# Altium project Thrust Stand Controller Revised.PrjPcb
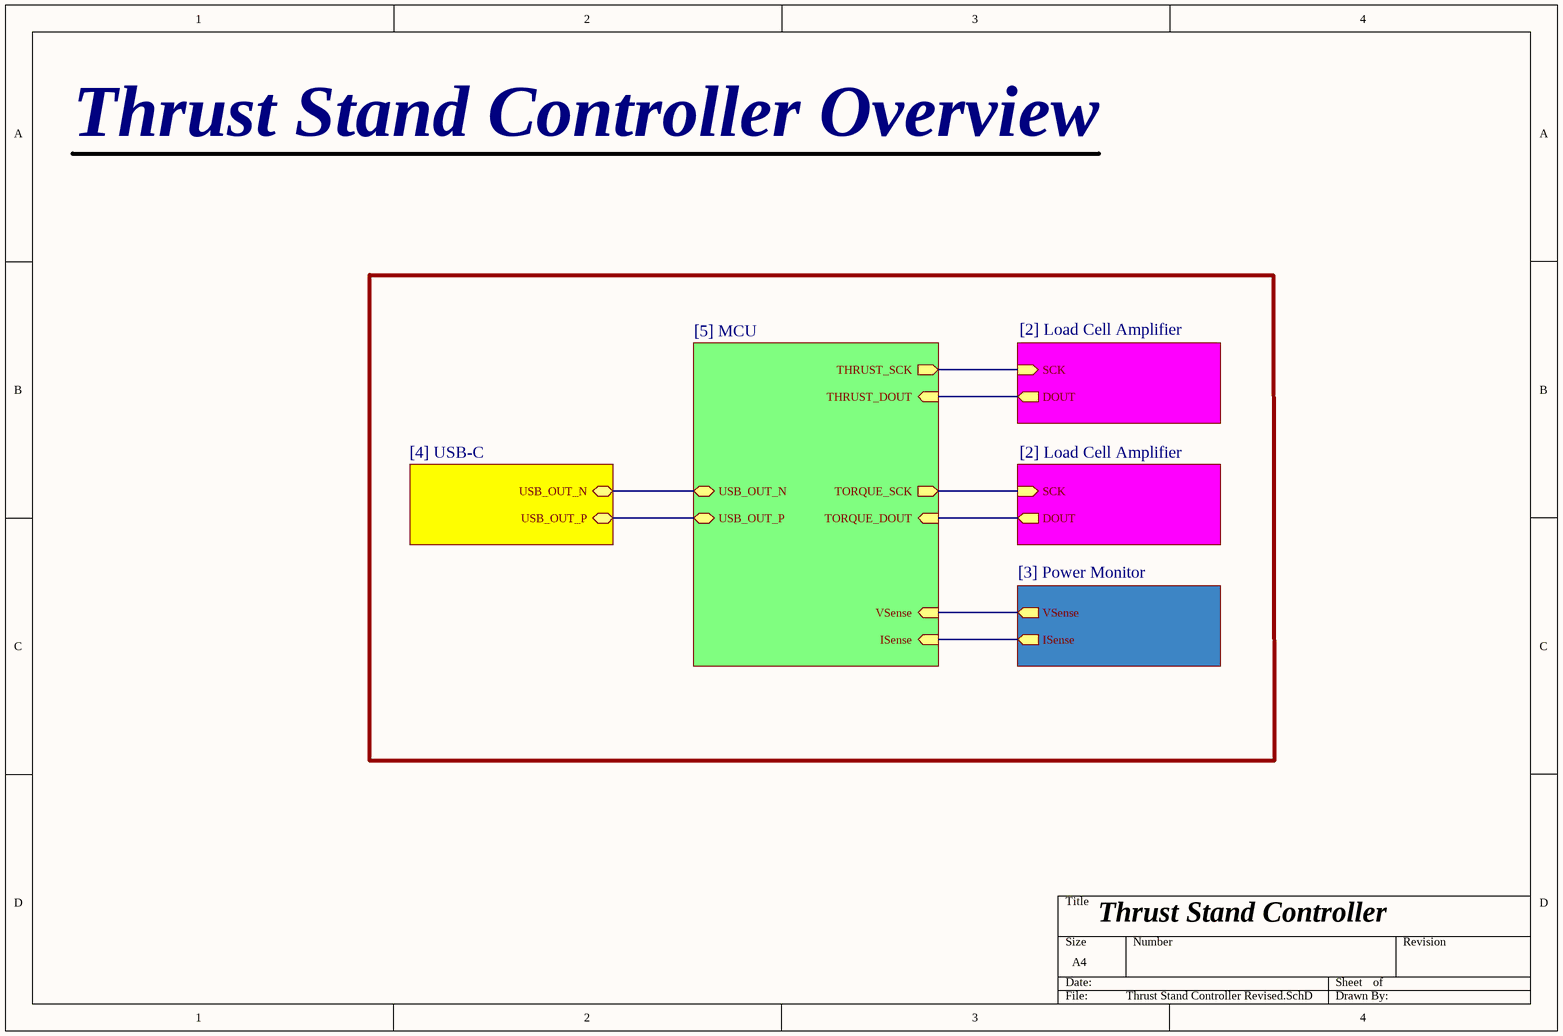
[diagram p0: Thrust Stand Controller Revised.SchDoc]
5 sheets, 68 parts. Net scope: hierarchical (ports join the sheet entries above them; power ports are global).
Board file: Thrust Stand Controller.PcbDoc
Sheets:
  Thrust Stand Controller Revised.SchDoc
    [2] Load Cell Amplifier = Load Cell Amplifier.SchDoc
    [4] USB-C = USB-C.SchDoc
    [3] Power Monitor = Power Monitor.SchDoc
    [2] Load Cell Amplifier = Load Cell Amplifier.SchDoc
    [5] MCU = MCU.SchDoc

## Sheet Thrust Stand Controller Revised.SchDoc
size A4; SheetNumber: 1; SheetTotal: 5

### Sub-sheets
[2] Load Cell Amplifier = Load Cell Amplifier.SchDoc: DOUT (out), SCK (in)
[2] Load Cell Amplifier = Load Cell Amplifier.SchDoc: DOUT (out), SCK (in)
[3] Power Monitor = Power Monitor.SchDoc: VSense (out), ISense (out)
[4] USB-C = USB-C.SchDoc: USB_OUT_N (bidir), USB_OUT_P (bidir)
[5] MCU = MCU.SchDoc: USB_OUT_N (bidir), USB_OUT_P (bidir), VSense (in), ISense (in), THRUST_SCK (out), THRUST_DOUT (in), TORQUE_SCK (out), TORQUE_DOUT (in)

### Nets
DOUT: sheet [2] Load Cell Amplifier/DOUT, sheet [5] MCU/TORQUE_DOUT
DOUT: sheet [2] Load Cell Amplifier/DOUT, sheet [5] MCU/THRUST_DOUT  [a separate net that carries the same name]
ISense: sheet [3] Power Monitor/ISense, sheet [5] MCU/ISense
SCK: sheet [2] Load Cell Amplifier/SCK, sheet [5] MCU/TORQUE_SCK
SCK: sheet [2] Load Cell Amplifier/SCK, sheet [5] MCU/THRUST_SCK  [a separate net that carries the same name]
USB_OUT_N: sheet [4] USB-C/USB_OUT_N, sheet [5] MCU/USB_OUT_N
USB_OUT_P: sheet [4] USB-C/USB_OUT_P, sheet [5] MCU/USB_OUT_P
VSense: sheet [3] Power Monitor/VSense, sheet [5] MCU/VSense

### Notes on the sheet
- Thrust Stand Controller Overview
- Thrust Stand Controller

## Sheet Load Cell Amplifier.SchDoc
size A4; SheetNumber: 2; SheetTotal: 5
Used 2 times, as channels [2] Load Cell Amplifier, [2] Load Cell Amplifier. Parts and nets are listed once, with the designators drawn on the sheet.
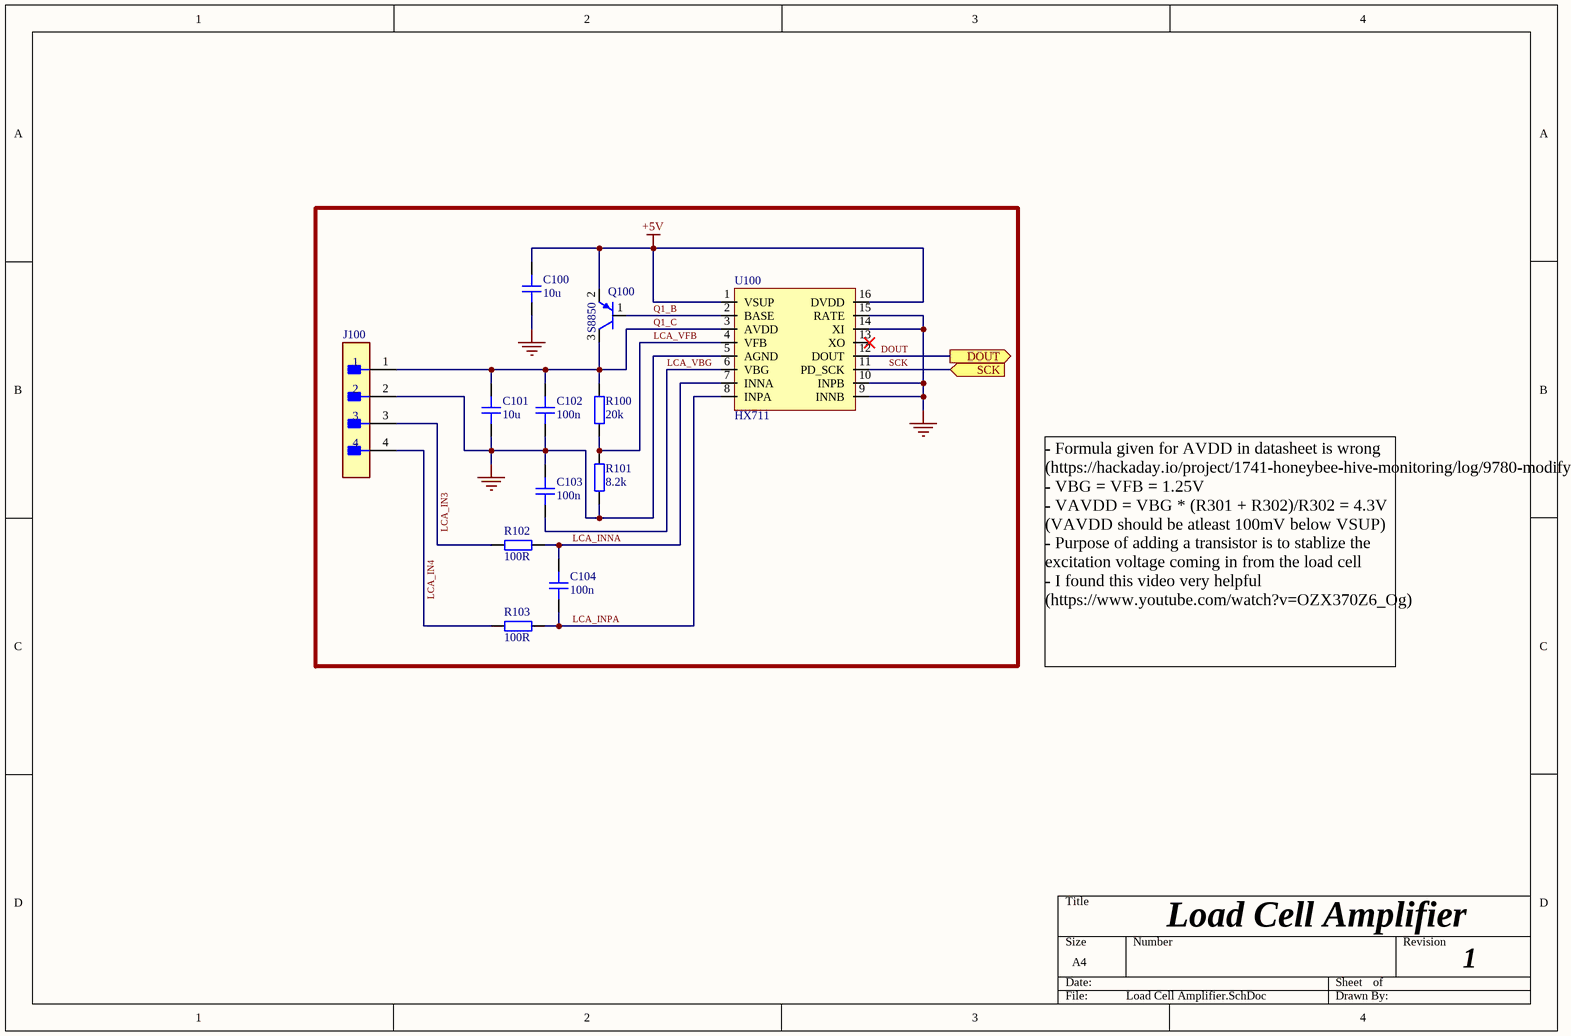
[diagram p1: Load Cell Amplifier.SchDoc]

### Parts
C100  10u  [CAP_0603]
C101  10u  [CAP_0603]
C102  100n  [CAP_0603]
C103  100n  [CAP_0603]
C104  100n  [CAP_0603]
J100  B4B-XH-A(LF)(SN)  [FP-B4B-XH-A_LF_SN-MFG]  (value not drawn)
Q100  S8850  [S8550]
R100  20k  [RES_0603]
R101  8.2k  [RES_0603]
R102  100R  [RES_0603]
R103  100R  [RES_0603]
U100  HX711  [HX711]

### Ports
DOUT (out, see Thrust Stand Controller Revised[3B]), SCK (in, see Thrust Stand Controller Revised[3B])

### Nets
+5V: C100.2 Q100.2 U100.1(VSUP) U100.16(DVDD)
GND: C100.1 C101.1 C102.1 C103.2 J100.2 R101.1 U100.5(AGND) U100.9(INNB) U100.10(INPB) U100.14(XI) U100.15(RATE)
DOUT: U100.12(DOUT) ; port DOUT
LCA_IN3: J100.3 R102.1
LCA_IN4: J100.4 R103.1
LCA_INNA: C104.2 R102.2 U100.7(INNA)
LCA_INPA: C104.1 R103.2 U100.8(INPA)
LCA_VBG: C103.1 U100.6(VBG)
LCA_VFB: R100.1 R101.2 U100.4(VFB)
Q1_B: Q100.1 U100.2(BASE)
Q1_C: C101.2 C102.2 J100.1 Q100.3 R100.2 U100.3(AVDD)
SCK: U100.11(PD_SCK) ; port SCK

Not connected (* = marked no-connect by the designer): U100 13(XO)*

### Channels
[2] Load Cell Amplifier: designators end in A; ports DOUT=DOUT SCK=SCK
[2] Load Cell Amplifier: designators end in B; ports DOUT=DOUT SCK=SCK

### Notes on the sheet
- - Formula given for AVDD in datasheet is wrong (https://hackaday.io/project/1741-honeybee-hive-monitoring/log/9780-modifying-the-hx711-breakout-board-for-33v-operation)
  - VBG = VFB = 1.25V                                               - VAVDD = VBG * (R301 + R302)/R302 = 4.3V (VAVDD should be atleast 100mV below VSUP)
  - Purpose of adding a transistor is to stablize the excitation voltage coming in from the load cell
  - I found this video very helpful (https://www.youtube.com/watch?v=OZX370Z6_Og)
- Load Cell Amplifier
- 1

### Library data of the parts
C100-C104 = CAP_0603: Capacitor SMD 0603; Manufacturer: *; Manufacturer Part Number: *; Distributor Link: *; LCSC: *; Rating: *; Dielectric: *
J100 = CMP-17439-000250-1: CONN HEADER VERT 4POS 2.5MM; Number of Contacts: 4; Contact Resistance: 20mR; Voltage Rating: 250V; Max Current Rating: 3A; Gender: Male; Wire/Cable Gauge: 22AWG; Mated Stacking Heights: 9.8mm; Insulation Resistance: 1GR; Orientation: Straight; Contact Type: Male Pin; Contact Finish - Mating: TIN; Series: XH; Max Voltage Rating (AC): 250V; Lead Pitch: 2.5mm; Contact Shape: Square; Insulation Color: Natural; Termination: Solder; Lead Free: Lead Free; Voltage Rating (AC): 250V; Number of Rows: 1; Flammability Rating: UL94 V-0; Number of Positions: 4; Max Operating Temperature: 85°C; Package Quantity: 500; Mount: Through Hole; REACH SVHC: No SVHC; Connector Type: Header; Insulation Material: Nylon; Fastening Type: Detent; Min Operating Temperature: -25°C; Housing Color: White; Packaging: Bulk; Contact Plating: Tin; Contact Material: Brass; Max Voltage Rating (DC): 250V; Housing Material: Polyamide; Color: Natural; Material: Polyamide; Pitch: 2.5mm; Depth: 5.75mm; Current Rating: 3A; Length: 12.4mm
Q100 = S8850: 25V 300mW 500mA SOT-23 Bipolar (BJT) ROHS; Manufacturer: JSMSEMI; JLCPCB Part Number: C916391; Package: SOT-23; Assembly Type: SMD
R100-R103 = RES_0603: Resistor SMD 0603; Manufacturer: *; Manufacturer Part Number: *; Distributor Link: *; LCSC: *
U100 = HX711: Manufacturer: AVIA(海芯科技); Supplier: LCSC; Manufacturer Part: HX711; Supplier Part: C43656; JLCPCB Part Class: Extended Part; spicePre: U; spiceSymbolName: HX711

## Sheet USB-C.SchDoc
size A4; SheetNumber: 4; SheetTotal: 5
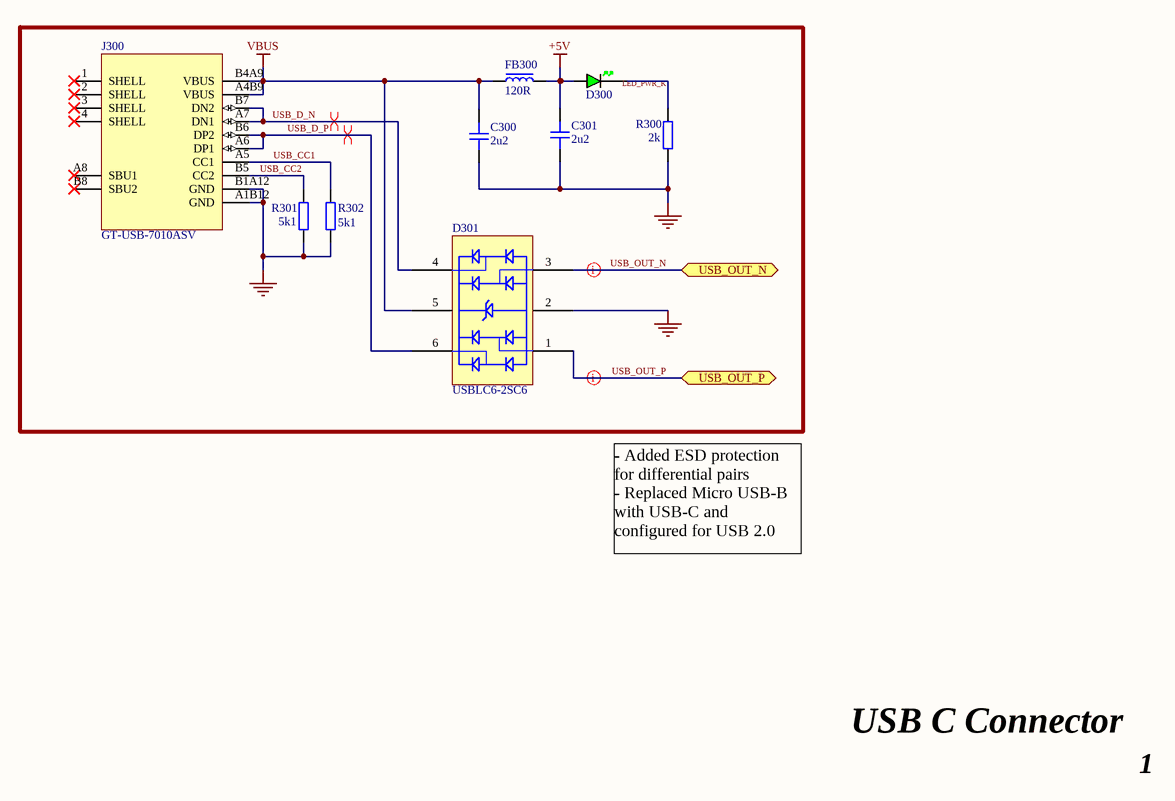
[diagram p2: USB-C.SchDoc]

### Parts
C300  2u2  [CAP_0603]
C301  2u2  [CAP_0603]
D300  GREEN  [LED_0603_GREEN]  (value not drawn)
D301  USBLC6-2SC6  [USBLC6-2SC6]
FB300  120R  [FB_0603]
J300  GT-USB-7010ASV  [GT-USB-7010ASV]
R300  2k  [RES_0603]
R301  5k1  [RES_0603]
R302  5k1  [RES_0603]

### Ports
USB_OUT_N (bidir, see Thrust Stand Controller Revised[2B], MCU[1B]), USB_OUT_P (bidir, see Thrust Stand Controller Revised[2C], MCU[1B])

### Nets
+5V: C301.2 D300.A FB300.2
GND: C300.1 C301.1 D301.2 J300.A1B12(GND) J300.B1A12(GND) R300.1 R301.1 R302.1
VBUS: C300.2 D301.5 FB300.1 J300.A4B9(VBUS) J300.B4A9(VBUS)
LED_PWR_K: D300.K R300.2
USB_CC1: J300.A5(CC1) R302.2
USB_CC2: J300.B5(CC2) R301.2
USB_D_N: D301.4 J300.A7(DN1) J300.B7(DN2)
USB_D_P: D301.6 J300.A6(DP1) J300.B6(DP2)
USB_OUT_N: D301.3 ; port USB_OUT_N
USB_OUT_P: D301.1 ; port USB_OUT_P

Not connected (* = marked no-connect by the designer): J300 1(SHELL)* 2(SHELL)* 3(SHELL)* 4(SHELL)* A8(SBU1)* B8(SBU2)*

### Layout directives
differential pair; differential pair class USB_OUT: USB_OUT_N, USB_OUT_P
differential pair; differential pair class DIFF_USB; rule Differential Pairs Routing [Pref Gap = 0.203mm    Min Gap  = 0.203mm    Max Gap  = 0.203mmPref Width = 0.281mm    Min Width  = 0.281mm    Max Width  = 0.281mm]: USB_D_N, USB_D_P

### Notes on the sheet
- - Added ESD protection for differential pairs                - Replaced Micro USB-B with USB-C and configured for USB 2.0
- USB C Connector
- 1

### Library data of the parts
C300 C301 = CAP_0603: Capacitor SMD 0603; Manufacturer: *; Manufacturer Part Number: *; Distributor Link: *; LCSC: *; Rating: *; Dielectric: *
D300 = LED_0603_GREEN: LED 0603 GREEN SMD
D301 = USBLC6-2SC6: 5A 17V 6V Unidirectional 5.25V SOT-23-6 ESD and Surge Protection (TVS/ESD) ROHS; Manufacturer: STMicroelectronics; MFR. Part Number: USBLC6-2SC6; JLCPCB Part Number: C7519; Supplier 1: Future Electronics; Supplier Part Number 1: 5742044
FB300 = FB_0603: Ferrite Bead SMD 0603; Manufacturer: *; Manufacturer Part Number: *; Distributor Link: *; LCSC: *
J300 = GT-USB-7010ASV: USB 2.0 3A 1 260℃ Horizontal attachment 16P Female -40℃~+85℃ Gold High conductivity copper Type-C SMD USB Connectors ROHS; Manufacturer: G-Switch; MFR. Part #: GT-USB-7010ASV; JLCPCB Part #: C2988369; Package: SMD
R300-R302 = RES_0603: Resistor SMD 0603; Manufacturer: *; Manufacturer Part Number: *; Distributor Link: *; LCSC: *

## Sheet Power Monitor.SchDoc
size A4; SheetNumber: 3; SheetTotal: 5
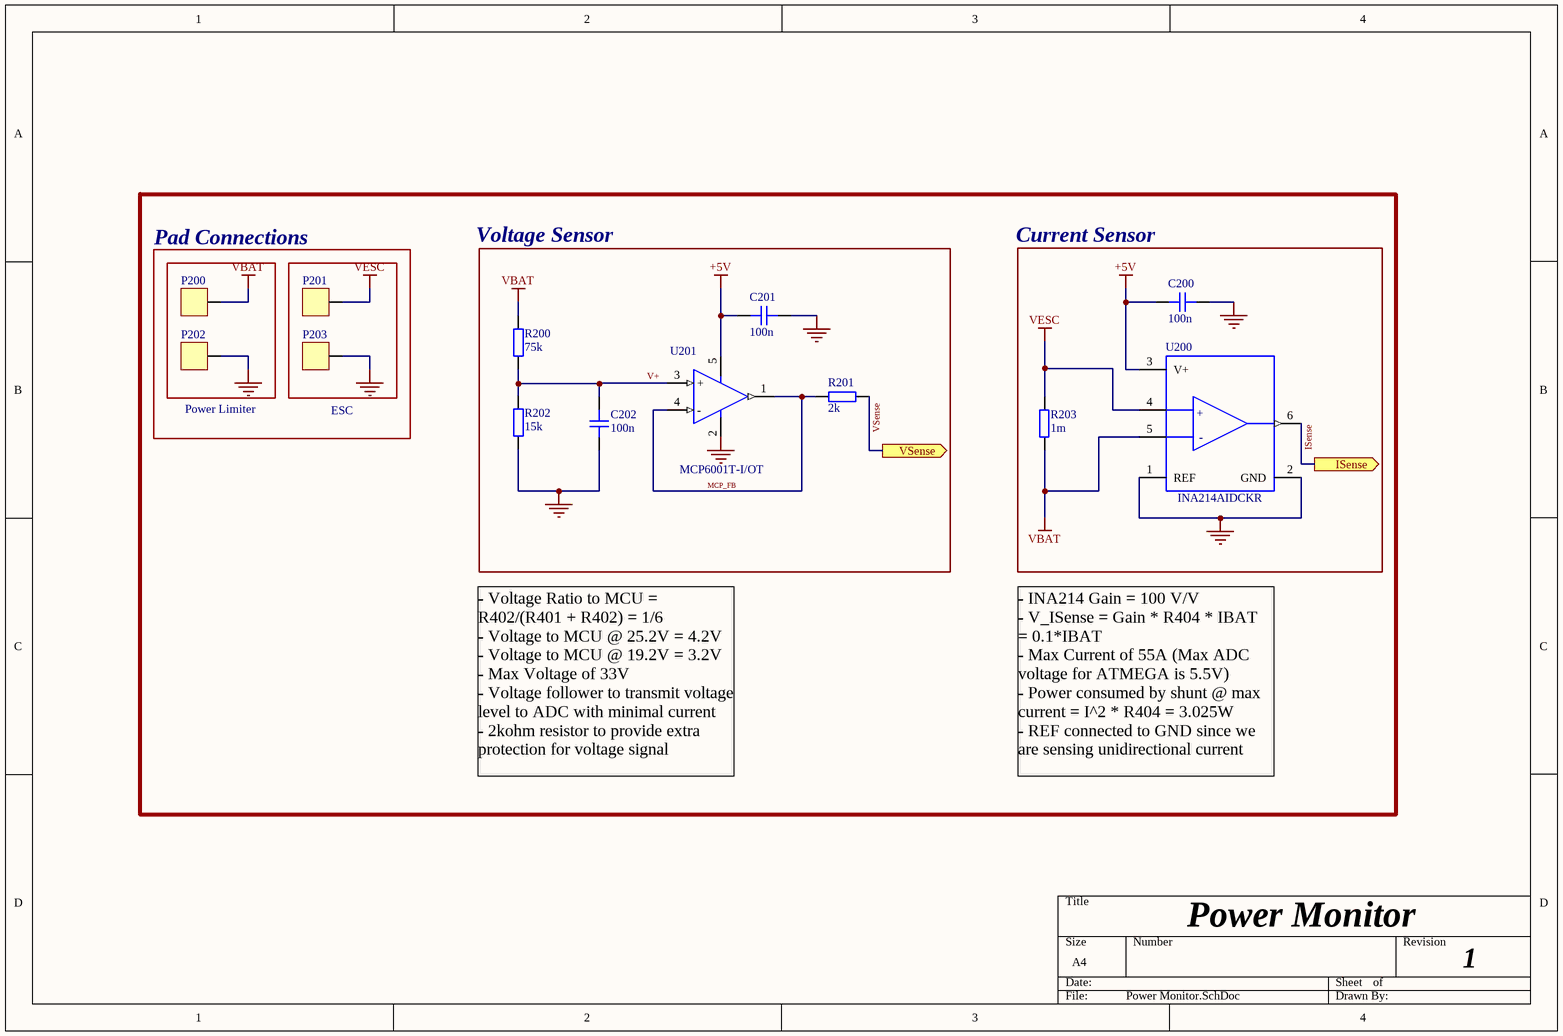
[diagram p3: Power Monitor.SchDoc]

### Parts
C200  100n  [CAP_0603]
C201  100n  [CAP_0603]
C202  100n  [CAP_0603]
P200  6mm x 6mm Solder Pad  [6mm x 6mm Solder Pad]  (value not drawn)
P201  6mm x 6mm Solder Pad  [6mm x 6mm Solder Pad]  (value not drawn)
P202  6mm x 6mm Solder Pad  [6mm x 6mm Solder Pad]  (value not drawn)
P203  6mm x 6mm Solder Pad  [6mm x 6mm Solder Pad]  (value not drawn)
R200  75k  [RES_0603]
R201  2k  [RES_0603]
R202  15k  [RES_0603]
R203  1m  [EBWM2512F1L00S9]
U200  INA214AIDCKR  [FP-DCK0006A-MFG]
U201  MCP6001T-I/OT  [MCP6001-I/OT]

### Blocks framed on the sheet
Voltage Sensor: C201 C202 R200-R202 U201
Pad Connections: P200-P203
Current Sensor: C200 R203 U200

### Ports
ISense (out, see Thrust Stand Controller Revised[3C], MCU[3B]), VSense (out, see Thrust Stand Controller Revised[3C], MCU[3C])

### Nets
+5V: C200.1 C201.1 U200.3(V+) U201.5
GND: C200.2 C201.2 C202.1 P202.1 P203.1 R202.2 U200.1(REF) U200.2(GND) U201.2
VBAT: P200.1 R200.1 R203.1 U200.5(IN-)
VESC: P201.1 R203.2 U200.4(IN+)
ISense: U200.6(VOUT) ; port ISense
MCP_FB: R201.1 U201.1 U201.4(-)
V+: C202.2 R200.2 R202.1 U201.3(+)
VSense: R201.2 ; port VSense

### Notes on the sheet
- (near P202) Power Limiter
- (near P203) ESC
- - Voltage Ratio to MCU = R402/(R401 + R402) = 1/6
  - Voltage to MCU @ 25.2V = 4.2V         - Voltage to MCU @ 19.2V = 3.2V            - Max Voltage of 33V                          - Voltage follower to transmit voltage level to ADC with minimal current                                                - 2kohm resistor to provide extra protection for voltage signal
- - INA214 Gain = 100 V/V
  - V_ISense = Gain * R404 * IBAT  = 0.1*IBAT                                               - Max Current of 55A (Max ADC voltage for ATMEGA is 5.5V)                                       - Power consumed by shunt @ max current = I^2 * R404 = 3.025W              - REF connected to GND since we are sensing unidirectional current
- Power Monitor
- 1
- (in symbol CMP-04910-000020-1) +; -

### Library data of the parts
C200-C202 = CAP_0603: Capacitor SMD 0603; Manufacturer: *; Manufacturer Part Number: *; Distributor Link: *; LCSC: *; Rating: *; Dielectric: *
R200-R202 = RES_0603: Resistor SMD 0603; Manufacturer: *; Manufacturer Part Number: *; Distributor Link: *; LCSC: *
R203 = EBWM2512F1L00S9: 6W 1mΩ Chip Current Sensing Resistors ±200ppm/℃ ±1% 2512 Current Sense Resistors / Shunt Resistors ROHS; Manufacturer: RESI; MFR. Part Number: EBWM2512F1L00S9; JLCPCB Part Number: C5224158; Package: 2512
U200 = CMP-04910-000020-1: IC CURRENT MONITOR 1% SC70-6 C105240; Manufacturer: Texas Instruments; Nominal Supply Current: 65uA; Number Of Outputs: 1; Min Supply Voltage: 2.7V; Max Junction Temp: +150°C; Max Supply Voltage: 26V; Standoff Height: 0mm; Lead Free: Yes; ComponentLink2Description: Datasheet; RoHS: TRUE; Package: DCK0006A; Mouser Description: SP Amp Current Shunt Monitor Single 26V 6-Pin SC-70 T/R; Manufacturer Part Number: INA214AIDCKR; Height: 1.1mm; Digikey Description: IC CURRENT MONITOR 1% SC70-6; Device Class L3: unset; Temperature Range Low: -40°C; Temperature Range High: +125°C; Ambient Temperature Range High: +125°C; Category: IC; Automotive: No; ComponentLink2URL: https://upverter.com/datasheet/f6da55a9132a31e577acef2c31156b568e2be49f.pdf; Device Class L1: Integrated Circuits (ICs); Temperature: -40°C to +125°C; Ambient Temperature Range Low: -40°C; Octopart: https://octopart.com/ina214aidckr-texas+instruments-12190780; Device Class L2: Power Management ICs
U201 = MCP6001T-I/OT: Supplier 1: Future Electronics; Supplier Part Number 1: 6195473

## Sheet MCU.SchDoc
size A4; SheetNumber: 5; SheetTotal: 5
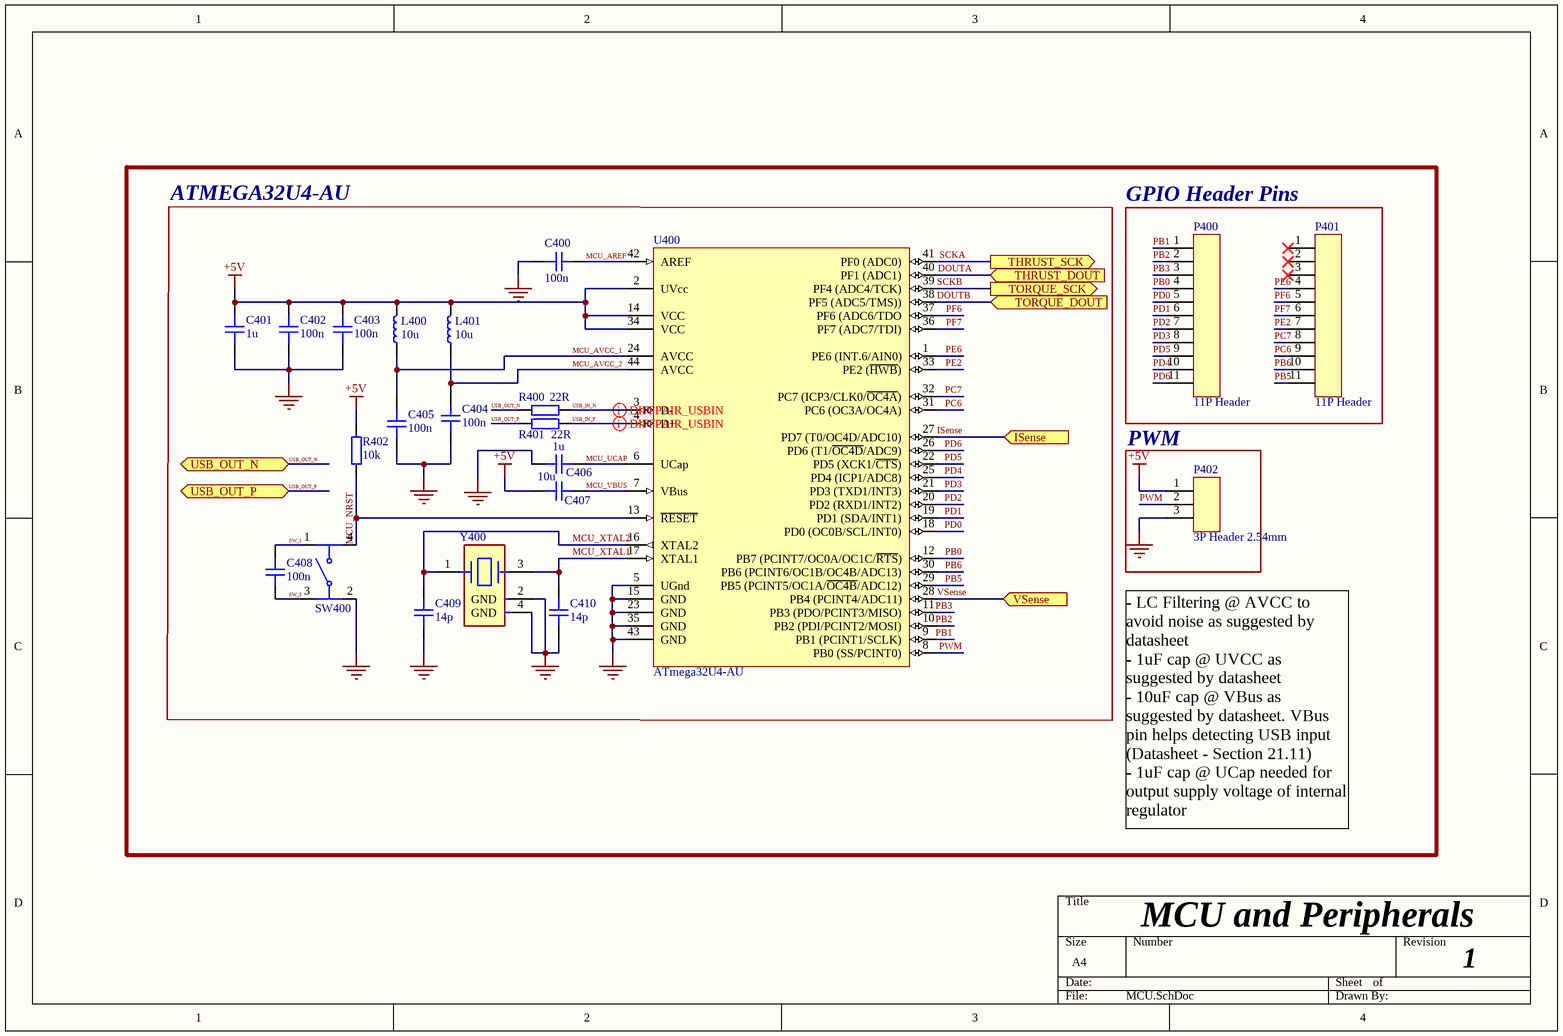
[diagram p4: MCU.SchDoc]

### Parts
C400  100n  [CAP_0603]
C401  1u  [CAP_0603]
C402  100n  [CAP_0603]
C403  100n  [CAP_0603]
C404  100n  [CAP_0603]
C405  100n  [CAP_0603]
C406  1u  [CAP_0603]
C407  10u  [CAP_0603]
C408  100n  [CAP_0603]
C409  14p  [CAP_0603]
C410  14p  [CAP_0603]
L400  10u  [IND_0603]
L401  10u  [IND_0603]
P400  11P Header  [PZ254-1-11-Z-2.5-G1]
P401  11P Header  [PZ254-1-11-Z-2.5-G1]
P402  3P Header 2.54mm  [3P Header 2.54mm]
R400  22R  [RES_0603]
R401  22R  [RES_0603]
R402  10k  [RES_0603]
SW400  C318884  [C318884]  (value not drawn)
U400  ATmega32U4-AU  [44ML_M]
Y400  7M-16.000MEEQ-T  [FP-7M-MFG]  (value not drawn)

### Blocks framed on the sheet
ATMEGA32U4-AU: C400-C410 L400 L401 R400-R402 SW400 U400 Y400
GPIO Header Pins: P400 P401
PWM: P402

### Ports
ISense (in, see Thrust Stand Controller Revised[3C], Power Monitor[4B]), THRUST_DOUT (in, see Thrust Stand Controller Revised[3B]), THRUST_SCK (out, see Thrust Stand Controller Revised[3B]), TORQUE_DOUT (in, see Thrust Stand Controller Revised[3C]), TORQUE_SCK (out, see Thrust Stand Controller Revised[3B]), USB_OUT_N (bidir, see Thrust Stand Controller Revised[2B], USB-C[3B]), USB_OUT_P (bidir, see Thrust Stand Controller Revised[2C], USB-C[3C]), VSense (in, see Thrust Stand Controller Revised[3C], Power Monitor[3B])

### Nets
+5V: C401.2 C402.2 C403.2 C407.2 L400.2 L401.2 P402.1 R402.2 U400.2(UVcc) U400.14(VCC) U400.34(VCC)
GND: C400.2 C401.1 C402.1 C403.1 C404.1 C405.1 C406.2 C409.1 C410.1 P402.3 SW400.2 U400.5(UGnd) U400.15(GND) U400.23(GND) U400.35(GND) U400.43(GND) Y400.2(GND) Y400.4(GND)
DOUTA: U400.40(PF1_(ADC1)) ; port THRUST_DOUT  [project net DOUT]
DOUTB: U400.38(PF5_(ADC5/TMS))) ; port TORQUE_DOUT  [project net DOUT]
ISense: U400.27(PD7_(T0/OC4D/ADC10)) ; port ISense
MCU_AREF: C400.1 U400.42(AREF)
MCU_AVCC_1: C405.2 L400.1 U400.24(AVCC)
MCU_AVCC_2: C404.2 L401.1 U400.44(AVCC)
MCU_NRST: R402.1 SW400.4 U400.13(~{RESET})
MCU_UCAP: C406.1 U400.6(UCap)
MCU_VBUS: C407.1 U400.7(VBus)
MCU_XTAL1: C410.2 U400.17(XTAL1) Y400.3
MCU_XTAL2: C409.2 U400.16(XTAL2) Y400.1
PB0: P400.4 U400.12(PB7_(PCINT7/OC0A/OC1C/~{RTS}))
PB1: P400.1 U400.9(PB1_(PCINT1/SCLK))
PB2: P400.2 U400.10(PB2_(PDI/PCINT2/MOSI))
PB3: P400.3 U400.11(PB3_(PDO/PCINT3/MISO))
PB5: P401.11 U400.29(PB5_(PCINT5/OC1A/~{OC4B}/ADC12))
PB6: P401.10 U400.30(PB6_(PCINT6/OC1B/OC4B/ADC13))
PC6: P401.9 U400.31(PC6_(OC3A/OC4A))
PC7: P401.8 U400.32(PC7_(ICP3/CLK0/~{OC4A}))
PD0: P400.5 U400.18(PD0_(OC0B/SCL/INT0))
PD1: P400.6 U400.19(PD1_(SDA/INT1))
PD2: P400.7 U400.20(PD2_(RXD1/INT2))
PD3: P400.8 U400.21(PD3_(TXD1/INT3))
PD4: P400.10 U400.25(PD4_(ICP1/ADC8))
PD5: P400.9 U400.22(PD5_(XCK1/~{CTS}))
PD6: P400.11 U400.26(PD6_(T1/~{OC4D}/ADC9))
PE2: P401.7 U400.33(PE2_(~{HWB}))
PE6: P401.4 U400.1(PE6_(INT.6/AIN0))
PF6: P401.5 U400.37(PF6_(ADC6/TDO)
PF7: P401.6 U400.36(PF7_(ADC7/TDI))
PWM: P402.2 U400.8(PB0_(SS/PCINT0))
SCKA: U400.41(PF0_(ADC0)) ; port THRUST_SCK  [project net SCK]
SCKB: U400.39(PF4_(ADC4/TCK)) ; port TORQUE_SCK  [project net SCK]
SW_1: C408.2 SW400.1
SW_3: C408.1 SW400.3
USB_IN_N: R400.2 U400.3(D-)
USB_IN_P: R401.2 U400.4(D+)
USB_OUT_N: R400.1 ; port USB_OUT_N
USB_OUT_P: R401.1 ; port USB_OUT_P
VSense: U400.28(PB4_(PCINT4/ADC11)) ; port VSense

Not connected (* = marked no-connect by the designer): P401 1* 2* 3*

### Layout directives
differential pair; differential pair class USB_IN; rule Differential Pairs Routing [Pref Gap = 0.203mm    Min Gap  = 0.203mm    Max Gap  = 0.203mmPref Width = 0.281mm    Min Width  = 0.281mm    Max Width  = 0.281mm]: USB_IN_N, USB_IN_P

### Notes on the sheet
- - LC Filtering @ AVCC to avoid noise as suggested by datasheet                                                    - 1uF cap @ UVCC as suggested by datasheet                                                    - 10uF cap @ VBus as suggested by datasheet. VBus pin helps detecting USB input (Datasheet - Section 21.11)              - 1uF cap @ UCap needed for output supply voltage of internal regulator
- MCU and Peripherals
- 1

### Library data of the parts
C400-C410 = CAP_0603: Capacitor SMD 0603; Manufacturer: *; Manufacturer Part Number: *; Distributor Link: *; LCSC: *; Rating: *; Dielectric: *
L400 L401 = IND_0603: Inductor SMD 0603
P400 P401 = PZ254-1-11-Z-2.5-G1: 3A Direct Insert Policy 2.5mm 260℃@10S 11P 6mm -40℃~+105℃ 3mm 2.54mm Brass Black Single Row 1x11P Plugin,P=2.54mm Pin Headers ROHS; Manufacturer: HCTL; MFR. Part Number: PZ254-1-11-Z-2.5-G1; JLCPCB Part Number: C18197918
P402 = PZ254V-11-03P: 250V 3A Direct Insert Policy 2.5mm 3P 6mm -40℃~+105℃ 3mm 2.54mm Single Row Black 1x3P Plugin,P=2.54mm Pin Headers ROHS; Manufacturer: XFCN; MFR. Part #: PZ254V-11-03P; JLCPCB Part #: C2937625; Package: Plugin,P=2.54mm
R400-R402 = RES_0603: Resistor SMD 0603; Manufacturer: *; Manufacturer Part Number: *; Distributor Link: *; LCSC: *
SW400 = C318884: None Without 50mA 5.1mm 100000 Times 160gf 12V 5.1mm 1.5mm Round Button Standing paste SPST SMD Tactile Switches ROHS; Manufacturer: XKB Connection; MFR Part Number: TS-1187 A-B-A-B; JLCPCB Part Number: C318884
U400 = CMP-0095-00285-2: 8-bit AVR Microcontroller, 2.7-5.5V, 16MHz, 32KB Flash, 1KB EEPROM, 2.5KB SRAM, USB Controller, 44-pin TQFP, Industrial Grade (-40°C to 85°C), Ext Osc; RevisionNote: DatasheetVersion updated. URLs added.; ComponentLink1Description: Manufacturer URL; PackageDescription: 44-Pin Plastic Thin Quad Flat Pack, 10 x 10 x 1.0 mm Body, 0.8 mm Pitch (TQFP); DatasheetVersion: revF, Nov-2010; ComponentLink2URL: http://www.atmel.com/dyn/resources/prod_documents/doc7766.pdf; ComponentLink1URL: http://www.atmel.com/; PackageReference: 44ML; ComponentLink2Description: ATmega16U4/32U4 Datasheet; PackageVersion: rev.G, Jul-2007; ComponentLink3URL: http://www.atmel.com/dyn/resources/prod_documents/7766S.pdf; ComponentLink3Description: ATmega16U4 ATmega32U4 Summary
Y400 = CMP-18717-000438-1: Crystal 16MHz, 10ppm, 10pF, 60Ω; ESR (Equivalent Series Resistance): 100R; Width: 2.5mm; REACH SVHC: No SVHC; Mount: Surface Mount; Package Quantity: 1; Depth: 2.5mm; Frequency Tolerance: 10ppm; Length: 3.2mm; Packaging: Tape and Reel; Termination: SMD/SMT; RoHS Compliant: Yes; Max Operating Temperature: 70°C; Min Operating Temperature: -10°C; Tolerance: 10ppm; Frequency Stability: 10ppm; Series: 7M; Height: 0.031inch; Number of Pins: 4; Load Capacitance: 10pF; Frequency: 16MHz; Case/Package: SMD/SMT

## Nets that join several sheets
+5V: [2] Load Cell Amplifier (C100A.2 Q100A.2 U100A.1 U100A.16), USB-C (C301.2 D300.A FB300.2), Power Monitor (C200.1 C201.1 U200.3 U201.5), [2] Load Cell Amplifier (C100B.2 Q100B.2 U100B.1 U100B.16), MCU (11 pins)
GND: [2] Load Cell Amplifier (11 pins), USB-C (8 pins), Power Monitor (9 pins), [2] Load Cell Amplifier (11 pins), MCU (18 pins)
DOUT: [2] Load Cell Amplifier (U100A.12), MCU (U400.38)
DOUT: [2] Load Cell Amplifier (U100B.12), MCU (U400.40)
ISense: Power Monitor (U200.6), MCU (U400.27)
SCK: [2] Load Cell Amplifier (U100A.11), MCU (U400.39)
SCK: [2] Load Cell Amplifier (U100B.11), MCU (U400.41)
USB_OUT_N: USB-C (D301.3), MCU (R400.1)
USB_OUT_P: USB-C (D301.1), MCU (R401.1)
VSense: Power Monitor (R201.2), MCU (U400.28)